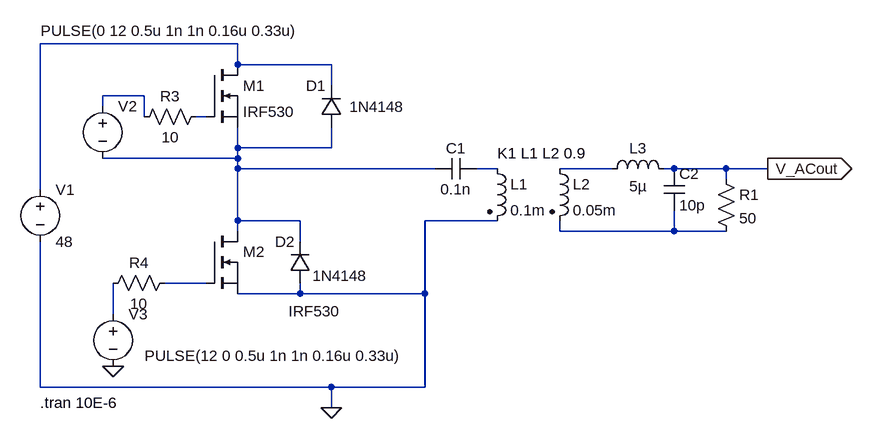
[diagram p0: schematic 3MHz_rezonansinverter.asc]
3MHz_rezonansinverter.asc, the LTspice schematic file:
Version 4
SHEET 1 896 680
WIRE -80 -112 -384 -112
WIRE -80 -80 -80 -112
WIRE 64 -80 -80 -80
WIRE 64 -48 64 -80
WIRE -224 -32 -288 -32
WIRE -288 -16 -288 -32
WIRE -224 0 -224 -32
WIRE -128 0 -144 0
WIRE -80 48 -80 16
WIRE 64 48 64 16
WIRE 64 48 -80 48
WIRE -80 64 -80 48
WIRE -80 64 -288 64
WIRE -80 80 -80 64
WIRE 224 80 -80 80
WIRE 320 80 288 80
WIRE 496 80 416 80
WIRE 592 80 576 80
WIRE 672 80 592 80
WIRE 736 80 672 80
WIRE 672 96 672 80
WIRE -384 112 -384 -112
WIRE -80 160 -80 80
WIRE 16 160 -80 160
WIRE 320 160 208 160
WIRE -80 176 -80 160
WIRE 416 176 416 160
WIRE 592 176 592 144
WIRE 592 176 416 176
WIRE 672 176 592 176
WIRE 16 192 16 160
WIRE -128 256 -192 256
WIRE 16 272 16 256
WIRE 16 272 -80 272
WIRE 208 272 208 160
WIRE 208 272 16 272
WIRE -272 304 -272 256
WIRE -384 416 -384 192
WIRE 64 416 -384 416
WIRE 208 416 208 272
WIRE 208 416 64 416
WIRE 64 448 64 416
FLAG -272 384 0
FLAG 64 448 0
FLAG 736 80 V_ACout
IOPIN 736 80 Out
SYMBOL ind2 304 64 R0
SYMATTR InstName L1
SYMATTR Value 0.1m
SYMATTR Type ind
SYMBOL ind2 400 64 R0
SYMATTR InstName L2
SYMATTR Value 0.05m
SYMATTR Type ind
SYMBOL cap 288 64 R90
WINDOW 0 0 32 VBottom 2
WINDOW 3 32 32 VTop 2
SYMATTR InstName C1
SYMATTR Value 0.1n
SYMBOL ind 480 96 R270
WINDOW 0 32 56 VTop 2
WINDOW 3 5 56 VBottom 2
SYMATTR InstName L3
SYMATTR Value 5µ
SYMBOL cap 576 80 R0
SYMATTR InstName C2
SYMATTR Value 10p
SYMBOL res 656 80 R0
SYMATTR InstName R1
SYMATTR Value 50
SYMBOL nmos -128 -80 R0
SYMATTR InstName M1
SYMATTR Value IRF530
SYMBOL nmos -128 176 R0
WINDOW 3 126 123 Left 2
SYMATTR Value IRF530
SYMATTR InstName M2
SYMBOL voltage -288 -32 R0
WINDOW 3 -95 -100 Left 2
WINDOW 123 0 0 Left 0
WINDOW 39 0 0 Left 0
SYMATTR Value PULSE(0 12 0.5u 1n 1n 0.16u 0.33u)
SYMATTR InstName V2
SYMBOL voltage -272 288 R0
WINDOW 3 49 80 Left 2
WINDOW 123 0 0 Left 0
WINDOW 39 0 0 Left 0
SYMATTR Value PULSE(12 0 0.5u 1n 1n 0.16u 0.33u)
SYMATTR InstName V3
SYMBOL voltage -384 96 R0
WINDOW 123 0 0 Left 0
WINDOW 39 0 0 Left 0
SYMATTR InstName V1
SYMATTR Value 48
SYMBOL res -128 -16 R90
WINDOW 0 0 56 VBottom 2
WINDOW 3 32 56 VTop 2
SYMATTR InstName R3
SYMATTR Value 10
SYMBOL res -176 240 R90
WINDOW 0 0 56 VBottom 2
WINDOW 3 32 56 VTop 2
SYMATTR InstName R4
SYMATTR Value 10
SYMBOL diode 80 16 R180
WINDOW 0 24 64 Left 2
WINDOW 3 -97 31 Left 2
SYMATTR InstName D1
SYMATTR Value 1N4148
SYMBOL diode 32 256 R180
WINDOW 0 24 64 Left 2
WINDOW 3 -88 11 Left 2
SYMATTR InstName D2
SYMATTR Value 1N4148
TEXT 320 56 Left 2 !K1 L1 L2 0.9
TEXT -384 440 Left 2 !.tran 10E-6

The netlist it stands for:
* 3MHz_rezonansinverter.asc
L1 N005 0 0.1m
L2 N006 N007 0.05m
C1 N005 N004 0.1n
L3 N006 V_ACout 5µ
C2 V_ACout N007 10p
R1 V_ACout N007 50
M1 N001 N003 N004 N004 IRF530
M2 N004 N008 0 0 IRF530
V2 N002 N004 PULSE(0 12 0.5u 1n 1n 0.16u 0.33u)
V3 N009 0 PULSE(12 0 0.5u 1n 1n 0.16u 0.33u)
V1 N001 0 48
R3 N003 N002 10
R4 N008 N009 10
D1 N004 N001 1N4148
D2 0 N004 1N4148
.model D D
.lib standard.dio
.model NMOS NMOS
.model PMOS PMOS
.lib standard.mos
K1 L1 L2 0.9
.tran 10E-6
.backanno
.end